# EAGLE board tottag (EAGLE 9.6.2), part 1 of 2
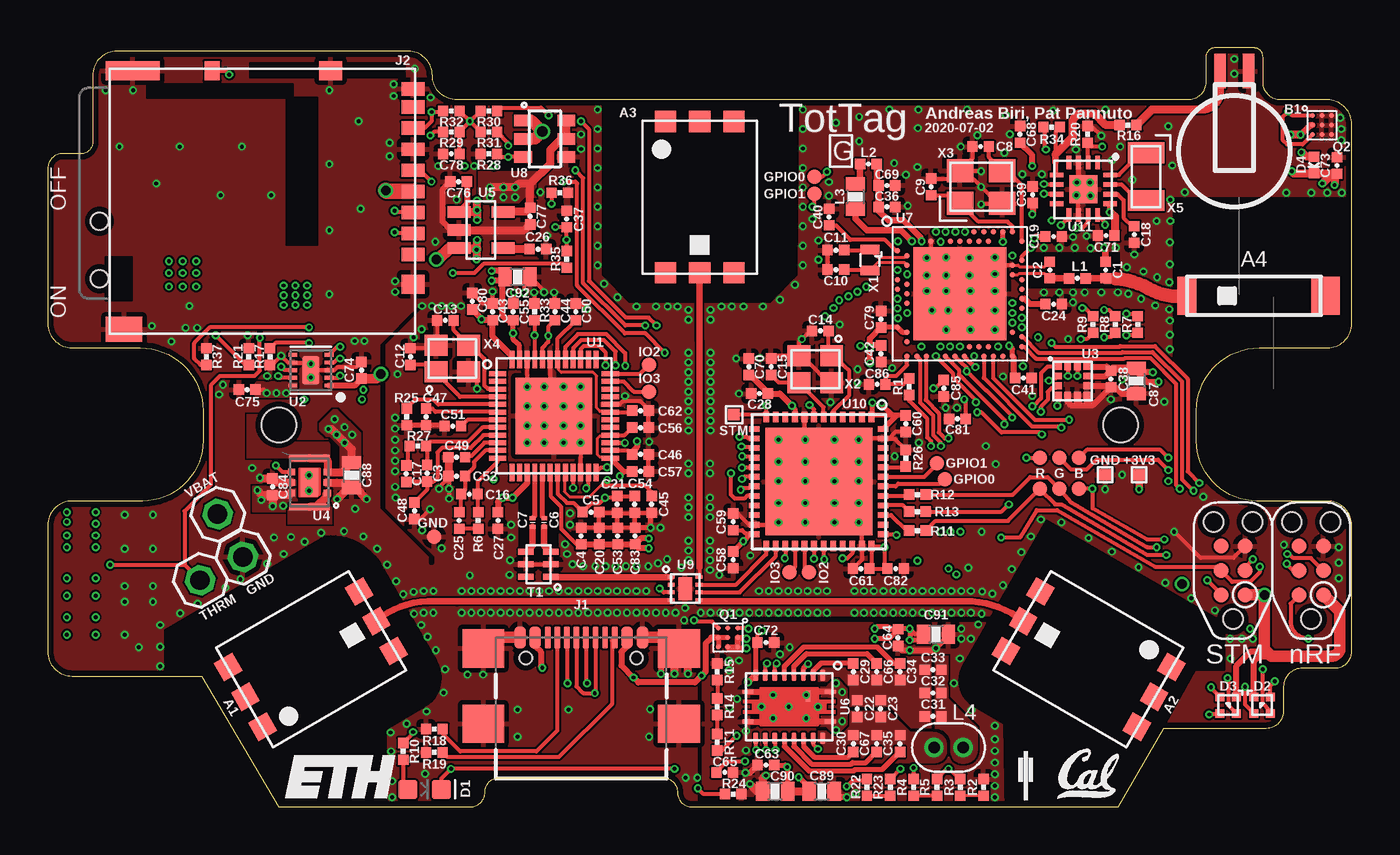
[diagram p4: board, top side]
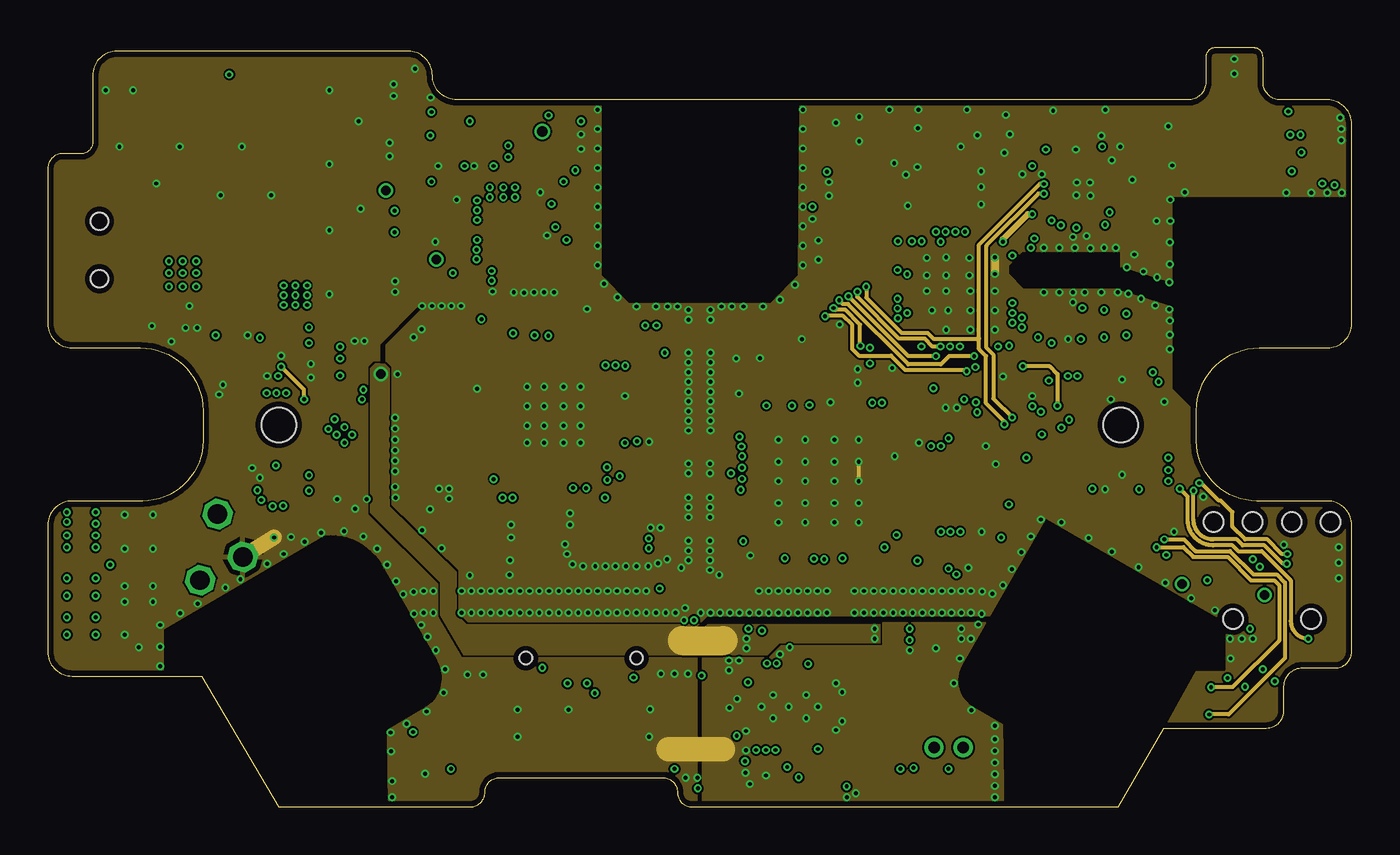
[diagram p5: board, inner layer Route2]
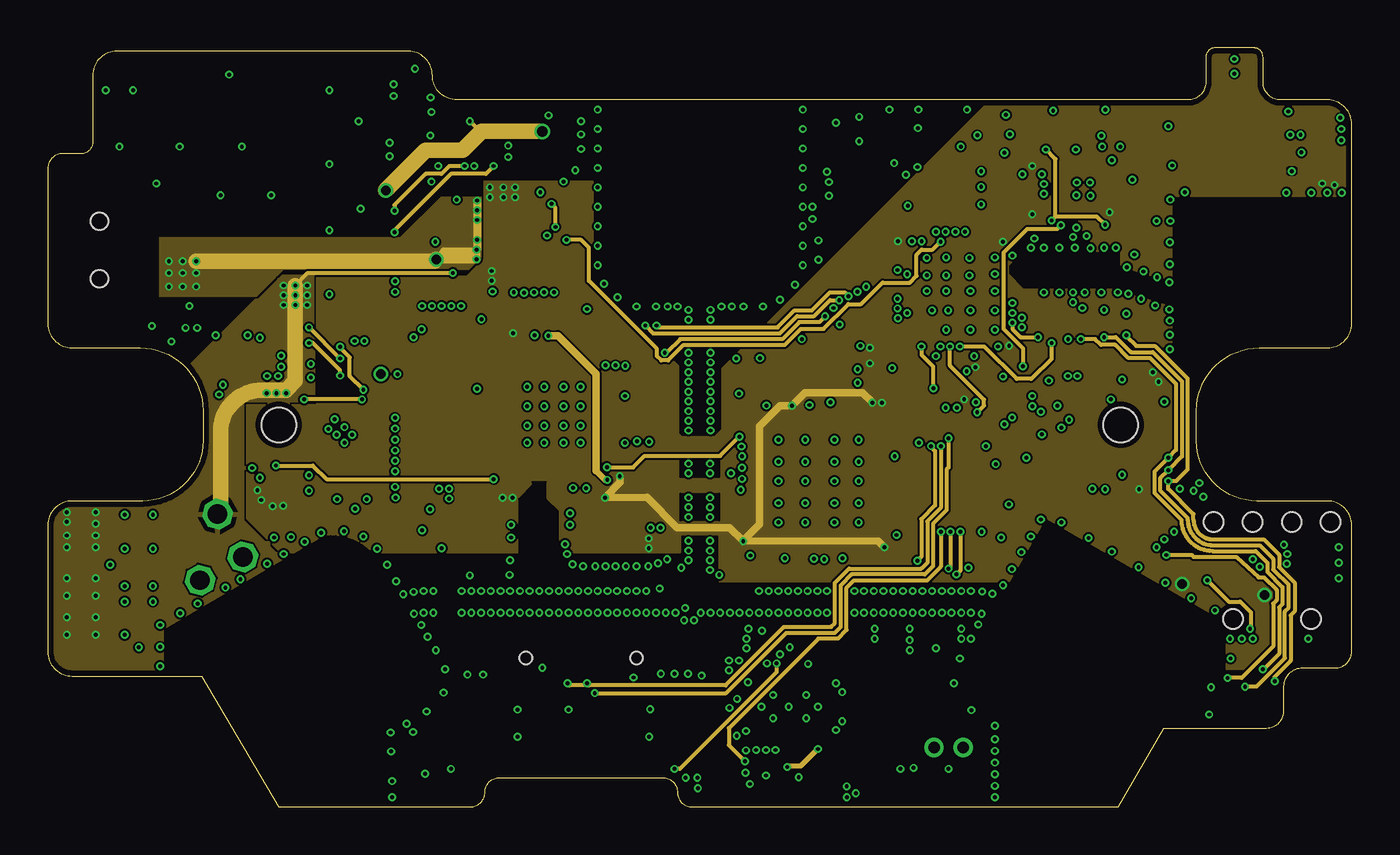
[diagram p6: board, inner layer Route15]
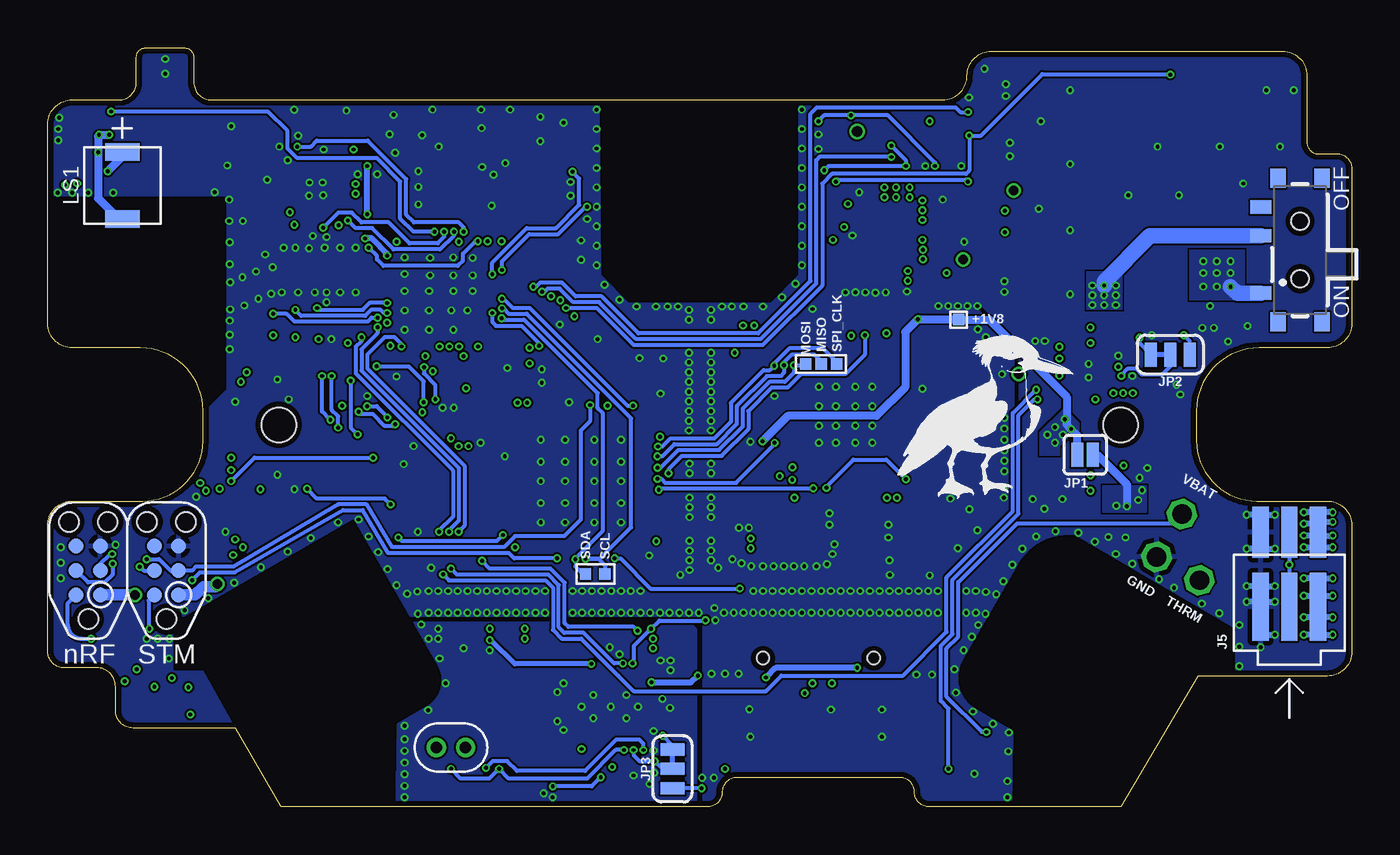
[diagram p7: board, bottom side, seen from below]

Size 68.14 x 39.65 mm. Coordinates in mm from the lower left corner, seen from the top.
Outline: 66.87,36.93 64.42,36.93 arc-90 63.51,37.85 63.51,39.17 arc90 63.02,39.65 60.99,39.65 arc90 60.51,39.17 60.51,37.85 arc-90 59.59,36.93 21.37,36.93 arc-90 20.1,38.2 arc90 18.83,39.47 3.61,39.47 arc90 2.34,38.2 2.34,34.7 arc-90 1.76,34.12 0.76,34.12 arc90 0,33.36 0,25.25 arc90 1.27,23.98 4.83,23.98 arc-90 8.11,20.69 8.11,19.14 arc-90 4.95,15.98 1.27,15.98 arc90 0,14.71 0,8.1 arc90 1.27,6.83 8.03,6.83 12.07,0 22.08,0 arc90 22.84,0.76 arc-90 23.6,1.52 32.14,1.52 arc-90 32.9,0.76 arc90 33.66,0 55.94,0 58.33,4.11 63.68,4.11 arc90 64.6,5.03 64.6,6.3 arc-90 65.56,7.26 67.29,7.26 arc90 68.14,8.11 68.14,14.71 arc90 66.87,15.98 63.18,15.98 arc-90 60.02,19.14 60.02,20.69 arc-90 63.31,23.98 66.87,23.98 arc90 68.14,25.25 68.14,35.66 arc90 66.87,36.93
Copper layers (1+2*15+16): Top 0.0356mm / dielectric 0.18mm / Route2 0.0356mm / dielectric 1.03mm / Route15 0.0356mm / dielectric 0.18mm / Bottom 0.0356mm
Design rules "quickturn_co_kr_1oz_4lyr *": minimum track width 4mil, minimum drill 8mil, track to track 4mil, track to pad 4mil, pad to pad 4mil, via to via 4mil, smd to smd 4mil, copper to edge 12mil, drill to drill 12mil, minimum pad ring 8mil, minimum via ring 4mil, stop-mask expansion 3mil, vias tented up to drill 50mil, thermal gap 10mil
Holes 1.8 mm at 12.07,19.95 56.07,19.95
tKeepout: area 19.3,9.6 to 32.3,11.7; area 34.3,9.6 to 48.8,11.7; area 33.1,12.4 to 35.1,25.7; area 9.7,19.3 to 14.4,20.7; area 53.8,19.3 to 58.3,20.7
tRestrict: area 24.6,13.2 to 26.7,17

## Footprints (pad centres in the part's own frame; a part is rotated, then mirrored left to right if it is on the bottom)
TP06SQ = smd 0.6 x 0.6: TP 0,0
TAIYO-YUDEN-AH086M = smd 1.1 x 1.1: A 0,-3.95; NC0 -1.8,3.95; NC1 0,3.95; NC2 1.8,3.95; NC3 1.8,-3.95; NC4 -1.8,-3.95
AMCA72-2R470G-S1F-T = smd 2 x 1.5: NC 0,3.75 | smd 2 x 1: S1 0,-3.5
MS518SE-FL35E = smd 1.8 x 0.6: + 4.2,0.75; - 4.2,-0.75
0402_CAP = smd 0.536 x 0.546: 1 -0.433,0; 2 0.433,0
0201_CAP = smd 0.3 x 0.21: P$1 0,0.22; P$2 0,-0.22
0603_CAP = smd 0.7 x 1: 1 -0.65,0; 2 0.65,0
LED-0603 = smd 1 x 1: A -0.877,0; C 0.877,0
1MM_SQ_4PAD = smd 0.457 x 0.457: 1 0.432,0.432; 2 0.432,-0.432; 3 -0.432,-0.432; 4 -0.432,0.432
0402_DIODE = smd 0.536 x 0.546: ANODE -0.433,0; CATHODE 0.433,0
PAD.03X.03 = smd 0.762 x 0.762: P$1 0,0
GCT_USB4110-GF-A = smd 0.6 x 1.15: A1/B12 -3.2,1.075; A4/B9 -2.4,1.075; B1/A12 3.2,1.075; B4/A9 2.4,1.075 | smd 0.3 x 1.15: A5 -1.25,1.075; A6 -0.25,1.075; A7 0.25,1.075; A8 1.25,1.075; B5 1.75,1.075; B6 0.75,1.075; B7 -0.75,1.075; B8 -1.75,1.075 | smd 2.18 x 2: S1 -5.11,0.5; S2 5.11,0.5; S3 -5.11,-3.43; S4 5.11,-3.43 | hole 0.65: -2.89,0; 2.89,0
DM3AT-SF-PEJM5 = smd 0.7 x 1.2: 1 3.2,-0.1; 2 2.1,-0.1; 3 1,-0.1; 4 -0.1,-0.1; 5 -1.2,-0.1; 6 -2.3,-0.1; 7 -3.4,-0.1; 8 -4.5,-0.1; B -5.45,-0.1 | smd 1 x 0.8: A -6.4,-10.6 | smd 1 x 1.2: MOUNT0 4.75,-0.1; MOUNT1 -6.4,-4.4 | smd 1 x 2.8: MOUNT2 -6.4,-14.75 | smd 1.3 x 1.9: MOUNT3 7.1,-15.2
TC2030-IDC-NL-2SIDE = smd 0.787 x 0.787: 1 -1.27,-0.635; 2 -1.27,0.635; 3 0,-0.635; 4 0,0.635; 5 1.27,-0.635; 6 1.27,0.635 | smd 0.787 x 0.787 bottom: B1 -1.27,0.635; B2 -1.27,-0.635; B3 0,0.635; B4 0,-0.635; B5 1.27,0.635; B6 1.27,-0.635 | hole 1.016: -2.54,0; 2.54,1.016; 2.54,-1.016
MOLEX-PICO-SPOX-3_SIDE = smd 3.55 x 0.85: 1 -1.725,1.5; 2 -1.725,0; 3 -1.725,-1.5 | smd 2.65 x 0.85: 1SUPP 2.175,1.5; 2SUPP 2.175,0; 3SUPP 2.175,-1.5
1X01 = drill 1.016 octagon: 1 0,0
SMT-JUMPER_2_NO_SILK = smd 0.635 x 1.27: 1 -0.406,0; 2 0.406,0
SMT-JUMPER_3_1-NC_TRACE_SILK = smd 0.635 x 1.27: 1 -1.016,0; 2 0,0; 3 1.016,0
WR222230-26M8-G = drill 0.6: P$1 0,0.762; P$2 0,-0.762
SMT-0440-T-2-R = smd 0.9 x 1.8: + 1.75,0; - -1.75,0
DSBGA = smd 0.25 x 0.25: A1 -0.5,0.5; A2 0,0.5; A3 0.5,0.5; B1 -0.5,0; B2 0,0; B3 0.5,0; C1 -0.5,-0.5; C2 0,-0.5; C3 0.5,-0.5
0402_RES = smd 0.536 x 0.546: 1 -0.433,0; 2 0.433,0
450404015514 = smd 0.7 x 1.1: 1 2.25,-2.05; 2 -0.75,-2.05; 3 -2.25,-2.05 | smd 1 x 0.8: Z1 -3.75,1.15; Z2 3.75,1.15; Z3 3.75,-1.15; Z4 -3.75,-1.15 | hole 0.9: -1.5,0; 1.5,0
EIA-0805 = smd 0.3 x 0.8: 1 -0.65,-0.65; 2 0,-0.65; 3 0.65,-0.65; 4 0.65,0.65; 5 0,0.65; 6 -0.65,0.65
QFN-48-DW1000 = smd 0.9 x 0.26: 1 -2.95,2.2; 2 -2.95,1.8; 3 -2.95,1.4; 4 -2.95,1; 5 -2.95,0.6; 6 -2.95,0.2; 7 -2.95,-0.2; 8 -2.95,-0.6; 9 -2.95,-1; 10 -2.95,-1.4; 11 -2.95,-1.8; 12 -2.95,-2.2; 25 2.95,-2.2; 26 2.95,-1.8; 27 2.95,-1.4; 28 2.95,-1; 29 2.95,-0.6; 30 2.95,-0.2; 31 2.95,0.2; 32 2.95,0.6; 33 2.95,1; 34 2.95,1.4; 35 2.95,1.8; 36 2.95,2.2 | smd 0.26 x 0.9: 13 -2.2,-2.95; 14 -1.8,-2.95; 15 -1.4,-2.95; 16 -1,-2.95; 17 -0.6,-2.95; 18 -0.2,-2.95; 19 0.2,-2.95; 20 0.6,-2.95; 21 1,-2.95; 22 1.4,-2.95; 23 1.8,-2.95; 24 2.2,-2.95; 37 2.2,2.95; 38 1.8,2.95; 39 1.4,2.95; 40 1,2.95; 41 0.6,2.95; 42 0.2,2.95; 43 -0.2,2.95; 44 -0.6,2.95; 45 -1,2.95; 46 -1.4,2.95; 47 -1.8,2.95; 48 -2.2,2.95 | smd 4 x 4: GND 0,0
DSQ0010A = smd 0.5 x 0.2: 1 -0.95,0.8; 2 -0.95,0.4; 3 -0.95,0; 4 -0.95,-0.4; 5 -0.95,-0.8; 6 0.95,-0.8; 7 0.95,-0.4; 8 0.95,0; 9 0.95,0.4; 10 0.95,0.8 | smd 0.9 x 1.5: PAD 0,0
LGA-12 = smd 0.375 x 0.35: 1 -0.75,0.75; 2 -0.75,0.25; 3 -0.75,-0.25; 4 -0.75,-0.75; 7 0.75,-0.75; 8 0.75,-0.25; 9 0.75,0.25; 10 0.75,0.75 | smd 0.35 x 0.375: 5 -0.25,-0.75; 6 0.25,-0.75; 11 0.25,0.75; 12 -0.25,0.75
XCL20X = smd 0.35 x 0.375: 1 -0.55,-0.938; 2 0,-0.938; 3 0.55,-0.938; 4 0.55,0.938; 5 0,0.938; 6 -0.55,0.938 | smd 0.35 x 2.1: 7 -1.275,0; 8 1.275,0 | smd 1.5 x 0.9: PAD 0,0
SOT-23-5 = smd 0.6 x 1.2: 1 -0.95,-1.15; 2 0,-1.15; 3 0.95,-1.15; 4 0.95,1.15; 5 -0.95,1.15
RHL0020A = smd 0.24 x 0.6: 1 -0.775,2.15; 10 -0.775,-2.15; 11 0.775,-2.15; 20 0.775,2.15 | smd 0.6 x 0.24: 2 -1.65,1.75; 3 -1.65,1.25; 4 -1.65,0.75; 5 -1.65,0.25; 6 -1.65,-0.25; 7 -1.65,-0.75; 8 -1.65,-1.25; 9 -1.65,-1.75; 12 1.65,-1.75; 13 1.65,-1.25; 14 1.65,-0.75; 15 1.65,-0.25; 16 1.65,0.25; 17 1.65,0.75; 18 1.65,1.25; 19 1.65,1.75; PAD -0.55,1
AQFN73 = smd 0.3 x 0.3: A8 -1.25,3.25; A10 -0.75,3.25; A12 -0.25,3.25; A14 0.25,3.25; A16 0.75,3.25; A18 1.25,3.25; A20 1.75,3.25; A22 2.25,3.25; A23 2.75,3.25; AA24 3.25,-2.25; AB2 -2.75,-2.5; AC5 -2,-2.75; AC9 -1,-2.75; AC11 -0.5,-2.75; AC13 0,-2.75; AC15 0.5,-2.75; AC17 1,-2.75; AC19 1.5,-2.75; AC21 2,-2.75; AC24 3.25,-2.75; AD2 -2.75,-3.25; AD4 -2.25,-3.25; AD6 -1.75,-3.25; AD8 -1.25,-3.25; AD10 -0.75,-3.25; AD12 -0.25,-3.25; AD14 0.25,-3.25; AD16 0.75,-3.25; AD18 1.25,-3.25; AD20 1.75,-3.25; AD22 2.25,-3.25; AD23 2.75,-3.25; B1 -3.25,2.75; B3 -2.5,2.75; B5 -2,2.75; B7 -1.5,2.75; B9 -1,2.75; B11 -0.5,2.75; B13 0,2.75; B15 0.5,2.75; B17 1,2.75; B19 1.5,2.75; B24 3.25,2.75; C1 -3.25,2.25; D2 -2.75,2; D23 2.75,2; E24 3.25,1.75; F2 -2.75,1.5; F23 2.75,1.5; G1 -3.25,1.25; H2 -2.75,1; H23 2.75,1; J1 -3.25,0.75; J24 3.25,0.75; K2 -2.75,0.5; L1 -3.25,0.25; L24 3.25,0.25; M2 -2.75,0; N1 -3.25,-0.25; N24 3.25,-0.25; P2 -2.75,-0.5; P23 2.75,-0.5; R1 -3.25,-0.75; R24 3.25,-0.75; T2 -2.75,-1; T23 2.75,-1; U1 -3.25,-1.25; U24 3.25,-1.25; V23 2.75,-1.5; W1 -3.25,-1.75; W24 3.25,-1.75; Y2 -2.75,-2; Y23 2.75,-2 | smd 4.85 x 4.85: GND 0,0
TSOT23-6 = smd 0.6 x 0.927: 1 -0.95,-1.126; 2 0,-1.126; 3 0.95,-1.126; 4 0.95,1.126; 5 0,1.126; 6 -0.95,1.126
MLPQ-UT-8 = smd 0.35 x 0.2: 1 -0.725,0.6; 2 -0.725,0.2; 3 -0.725,-0.2; 4 -0.725,-0.6; 5 0.725,-0.6; 6 0.725,-0.2; 7 0.725,0.2; 8 0.725,0.6 | smd 0.7 x 1.2: GND 0,0
UFQFPN-48 = smd 0.55 x 0.3: 1 -3.375,2.75; 2 -3.375,2.25; 3 -3.375,1.75; 4 -3.375,1.25; 5 -3.375,0.75; 6 -3.375,0.25; 7 -3.375,-0.25; 8 -3.375,-0.75; 9 -3.375,-1.25; 10 -3.375,-1.75; 11 -3.375,-2.25; 12 -3.375,-2.75; 25 3.375,-2.75; 26 3.375,-2.25; 27 3.375,-1.75; 28 3.375,-1.25; 29 3.375,-0.75; 30 3.375,-0.25; 31 3.375,0.25; 32 3.375,0.75; 33 3.375,1.25; 34 3.375,1.75; 35 3.375,2.25; 36 3.375,2.75 | smd 0.3 x 0.55: 13 -2.75,-3.375; 14 -2.25,-3.375; 15 -1.75,-3.375; 16 -1.25,-3.375; 17 -0.75,-3.375; 18 -0.25,-3.375; 19 0.25,-3.375; 20 0.75,-3.375; 21 1.25,-3.375; 22 1.75,-3.375; 23 2.25,-3.375; 24 2.75,-3.375; 37 2.75,3.375; 38 2.25,3.375; 39 1.75,3.375; 40 1.25,3.375; 41 0.75,3.375; 42 0.25,3.375; 43 -0.25,3.375; 44 -0.75,3.375; 45 -1.25,3.375; 46 -1.75,3.375; 47 -2.25,3.375; 48 -2.75,3.375 | smd 5.6 x 5.6: GND 0,0
QFN-16-3MM = smd 0.7 x 0.25: 1 -1.4,0.75; 2 -1.4,0.25; 3 -1.4,-0.25; 4 -1.4,-0.75; 9 1.35,-0.75; 10 1.35,-0.25; 11 1.35,0.25; 12 1.35,0.75 | smd 0.25 x 0.7: 5 -0.75,-1.4; 6 -0.25,-1.4; 7 0.25,-1.4; 8 0.75,-1.4; 13 0.75,1.4; 14 0.25,1.4; 15 -0.25,1.4; 16 -0.75,1.4 | smd 1.45 x 1.45: GND 0,0
ABS05 = smd 0.5 x 1: A -0.55,0; B 0.55,0
FA-20H = smd 1.1 x 1.2: 1 -0.7,0.85; 2 -0.7,-0.85; 3 0.7,-0.85; 4 0.7,0.85
TXC-7V = smd 1.4 x 1.2: 1 -1.1,-0.85; 2 1.1,-0.85; 3 1.1,0.85; 4 -1.1,0.85
ABS07 = smd 1.092 x 1.905: 1 -1.245,0; 2 1.245,0

## Placement (x,y rotation side)
+1V8  TPTP06SQ  [TP06SQ]  20.53,25.45 0 bottom
A1  TAIYO-YUDEN-AH086M  [TAIYO-YUDEN-AH086M]  13.75,7.72 120 top
A2  TAIYO-YUDEN-AH086M  [TAIYO-YUDEN-AH086M]  54.39,7.72 240 top
A3  TAIYO-YUDEN-AH086M  [TAIYO-YUDEN-AH086M]  34.07,31.85 0 top
A4  AMCA72-2R47G-S1F-T  [AMCA72-2R470G-S1F-T]  63.02,26.7 270 top
B1  [MS518SE-FL35E]  62.01,34.24 90 top
C1  0.5pF  [0402_CAP]  55.28,28.04 90 top
C2  0.8pF  [0402_CAP]  52.36,28.04 90 top
C3  1.2pF  [0402_CAP]  19.82,17.42 270 top
C4  10pF  [0402_CAP]  27.87,14.15 90 top
C5  10pF  [0402_CAP]  28.38,15.39 0 top
C6  12pF  [0201_CAP]  25.94,14.86 0 top
C7  12pF  [0201_CAP]  25.33,14.86 0 top
C8  12pF  [0402_CAP]  48.75,34.49 0 top
C9  12pF  [0402_CAP]  46.16,32.38 270 top
C10  12pF  [0402_CAP]  41.18,28.07 0 top
C11  12pF  [0402_CAP]  41.18,29.08 0 top
C12  12pF  [0402_CAP]  18.95,23.52 90 top
C13  12pF  [0402_CAP]  20.77,25.41 180 top
C14  12pF  [0402_CAP]  40.37,24.87 180 top
C15  12pF  [0402_CAP]  37.8,22.99 90 top
C16  18pF  [0402_CAP]  22.03,16.33 180 top
C17  27pF  [0402_CAP]  18.73,17.4 270 top
C18  47pF  [0402_CAP]  56.78,29.9 270 top
C19  100pF  [0402_CAP]  52.56,29.79 0 top
C20  330pF  [0402_CAP]  28.81,14.15 90 top
C21  330pF  [0402_CAP]  29.75,15.8 270 top
C22  470pF  [0402_CAP]  42.3,5.13 270 top
C23  470pF  [0402_CAP]  43.52,5.13 270 top
C24  820pF  [0402_CAP]  52.56,26.26 0 top
C25  820pF  [0402_CAP]  21.49,14.96 90 top
C26  10nF  [0402_CAP]  25.61,29.13 0 top
C27  10nF  [0402_CAP]  23.53,14.96 270 top
C28  10nF  [0402_CAP]  37.19,21.59 180 top
C29  10nF  [0402_CAP]  42.09,7.06 270 top
C30  10nF  [0402_CAP]  42.09,3.3 90 top
C31  22nF  [0402_CAP]  46.26,4.72 0 top
C32  22nF  [0402_CAP]  46.26,5.94 0 top
C33  22nF  [0402_CAP]  46.26,7.16 0 top
C34  22nF  [0402_CAP]  44.53,7.06 270 top
C35  22nF  [0402_CAP]  44.53,3.3 90 top
C36  47nF  [0402_CAP]  43.85,31.34 0 top
C37  0.1uF  [0402_CAP]  27.11,30.71 270 top
C38  0.1uF  [0402_CAP]  55.56,22.35 270 top
C39  0.1uF  [0402_CAP]  51.47,31.98 90 top
C40  0.1uF  [0402_CAP]  40.82,30.81 90 top
C41  0.1uF  [0402_CAP]  50.98,22.4 0 top
C42  0.1uF  [0402_CAP]  43.54,23.67 270 top
C43  0.1uF  [0402_CAP]  23.25,25.86 90 top
C44  0.1uF  [0402_CAP]  26.5,25.86 90 top
C45  0.1uF  [0402_CAP]  31.55,15.8 270 top
C46  0.1uF  [0402_CAP]  30.97,18.41 0 top
C47  0.1uF  [0402_CAP]  19.77,20.37 270 top
C48  0.1uF  [0402_CAP]  19.16,15.47 270 top
C49  0.1uF  [0402_CAP]  21.37,18.26 180 top
C50  0.1uF  [0402_CAP]  27.59,25.86 90 top
C51  0.1uF  [0402_CAP]  21.16,19.89 180 top
C52  0.1uF  [0402_CAP]  21.37,17.27 180 top
C53  0.1uF  [0402_CAP]  29.78,14.15 90 top
C54  0.1uF  [0402_CAP]  30.66,15.8 270 top
C55  0.1uF  [0402_CAP]  24.31,25.86 90 top
C56  0.1uF  [0402_CAP]  30.97,19.81 0 top
C57  0.1uF  [0402_CAP]  30.97,17.53 0 top
C58  0.1uF  [0402_CAP]  35.82,12.9 270 top
C59  0.1uF  [0402_CAP]  35.82,14.88 90 top
C60  0.1uF  [0402_CAP]  44.84,20.02 270 top
C61  0.1uF  [0402_CAP]  42.5,12.45 180 top
C62  0.1uF  [0402_CAP]  30.97,20.7 0 top
C63  0.1uF  [0402_CAP]  37.52,2.18 180 top
C64  0.1uF  [0402_CAP]  44.43,8.84 270 top
C65  0.1uF  [0402_CAP]  35.38,1.8 0 top
C66  470nF  [0402_CAP]  43.31,7.06 270 top
C67  470nF  [0402_CAP]  43.31,3.3 90 top
C68  1uF  [0402_CAP]  50.81,35.13 90 top
C69  1uF  [0402_CAP]  43.85,32.46 0 top
C70  1uF  [0402_CAP]  36.63,22.99 90 top
C71  1uF  [0402_CAP]  55.3,29.84 180 top
C72  1uF  [0402_CAP]  37.52,8.59 180 top
C73  1uF  [0402_CAP]  67.37,33.5 90 top
C74  1uF  [0402_CAP]  16.39,22.81 90 top
C75  1uF  [0402_CAP]  10.42,21.79 180 top
C76  4.7uF  [0402_CAP]  21.46,32.66 180 top
C77  4.7uF  [0402_CAP]  25.2,30.86 270 top
C78  4.7uF  [0402_CAP]  21.09,34.11 180 top
C79  4.7uF  [0402_CAP]  43.54,25.48 90 top
C80  4.7uF  [0402_CAP]  22.18,26.42 90 top
C81  4.7uF  [0402_CAP]  47.53,20.27 180 top
C82  4.7uF  [0402_CAP]  44.3,12.45 0 top
C83  4.7uF  [0402_CAP]  30.69,14.15 90 top
C84  4.7uF  [0402_CAP]  11.74,16.71 90 top
C85  4.7uF  [0402_CAP]  46.82,21.87 270 top
C86  4.7uF  [0402_CAP]  43.34,22.07 180 top
C87  10uF  [0603_CAP]  56.88,22.25 270 top
C88  10uF  [0603_CAP]  15.88,17.32 270 top
C89  10uF  [0603_CAP]  40.44,0.81 0 top
C90  10uF  [0603_CAP]  38,0.81 180 top
C91  10uF  [0603_CAP]  46.41,9.02 0 top
C92  47uF  [0603_CAP]  24.54,27.69 0 top
D1  GREEN  [LED-0603]  19.69,0.91 0 top
D2  SML-LX0404SIUPGUSB  [1MM_SQ_4PAD]  63.46,5.31 90 top
D3  SML-LX0404SIUPGUSB  [1MM_SQ_4PAD]  61.68,5.31 0 top
D4  DIODE0402  [0402_DIODE]  66.17,33.53 270 top
GPIO0  TEST-POINT  [PAD.03X.03]  46.87,17.12 0 top
GPIO1  TEST-POINT  [PAD.03X.03]  46.46,17.96 0 top
J1  USB4110-GF-A  [GCT_USB4110-GF-A]  27.87,7.77 0 top
J2  DM3AT-SF-PEJM5  [DM3AT-SF-PEJM5]  19.18,32.05 270 top
J3  TC2030-JLINK-NL-2SIDE  [TC2030-IDC-NL-2SIDE]  66.02,12.34 90 top
J4  TC2030-JLINK-NL-2SIDE  [TC2030-IDC-NL-2SIDE]  61.93,12.34 90 top
J5  MOLEX-PICO-SPOX-3SIDE  [MOLEX-PICO-SPOX-3_SIDE]  3.26,12.17 90 bottom
J6  [1X01]  8.87,15.29 30 top
J7  [1X01]  7.96,11.84 30 top
J8  [1X01]  10.19,13.06 30 top
JP1  JUMPER-SMT_2_NO_SILK  [SMT-JUMPER_2_NO_SILK]  13.93,18.39 180 bottom
JP2  JUMPER-SMT_3_1-NC_TRACE_SILK  [SMT-JUMPER_3_1-NC_TRACE_SILK]  9.48,23.62 180 bottom
JP3  JUMPER-SMT_3_1-NC_TRACE_SILK  [SMT-JUMPER_3_1-NC_TRACE_SILK]  35.49,1.98 90 bottom
L1  4.7nH  [0402_CAP]  53.8,27.61 180 top
L2  15nH  [0402_CAP]  42.88,33.58 180 top
L3  10uH  [0603_CAP]  42.2,31.88 270 top
L4  WR222230-26M8-G  [WR222230-26M8-G]  47.07,3.1 270 top
LS1  PUI_SMT-0440-T-2-R  [SMT-0440-T-2-R]  64.24,32.46 90 bottom
MISO  TPTP06SQ  [TP06SQ]  27.72,23.14 0 bottom
MOSI  TPTP06SQ  [TP06SQ]  28.53,23.14 0 bottom
Q1  CSD75207W15  [DSBGA]  35.54,8.84 270 top
Q2  CSD75207W15  [DSBGA]  66.58,35.61 0 top
R1  4.7  [0402_RES]  45.02,21.95 90 top
R2  97.6  [0402_RES]  48.9,1.02 90 top
R3  97.6  [0402_RES]  47.68,1.02 270 top
R4  162  [0402_RES]  45.24,1.02 270 top
R5  162  [0402_RES]  46.46,1.02 90 top
R6  270  [0402_RES]  22.49,14.96 270 top
R7  1k  [0402_RES]  56.95,25.2 90 top
R8  1k  [0402_RES]  55.78,25.2 90 top
R9  1k  [0402_RES]  54.62,25.2 90 top
R10  1k  [0402_RES]  18.57,2.9 270 top
R11  1k  [0402_RES]  45.45,14.43 180 top
R12  1k  [0402_RES]  45.45,16.31 180 top
R13  1k  [0402_RES]  45.45,15.42 180 top
R14  1k  [0402_RES]  34.98,5.23 270 top
R15  1k  [0402_RES]  34.98,7.06 270 top
R16  1.41k  [0402_RES]  56.45,35.61 0 top
R17  2.2k  [0402_RES]  11.61,23.52 90 top
R18  5.1k  [0402_RES]  20.2,4.06 180 top
R19  5.1k  [0402_RES]  20.2,2.84 180 top
R20  10k  [0402_RES]  54.34,35.13 90 top
R21  10k  [0402_RES]  10.5,23.52 270 top
R22  10k  [0402_RES]  42.81,1.02 270 top
R23  10k  [0402_RES]  44.02,1.02 90 top
R24  10k  [0402_RES]  35.82,0.66 180 top
R25  11k  [0402_RES]  18.75,20.37 90 top
R26  11k  [0402_RES]  44.84,18.21 90 top
R27  16k  [0402_RES]  19.34,18.85 180 top
R28  100k  [0402_RES]  23.04,34.11 180 top
R29  100k  [0402_RES]  21.09,35.26 0 top
R30  100k  [0402_RES]  23.04,36.35 180 top
R31  100k  [0402_RES]  23.04,35.26 180 top
R32  100k  [0402_RES]  21.09,36.35 0 top
R33  100k  [0402_RES]  25.43,25.86 270 top
R34  100k  [0402_RES]  52.46,35.51 180 top
R35  3.3M  [0402_RES]  27.11,28.6 270 top
R36  10M  [0402_RES]  26.75,32.08 180 top
R37  DNP  [0402_RES]  8.29,23.52 270 top
RT1  10k@25C  [0402_RES]  34.98,3.38 270 top
S1  [450404015514]  2.7,29.08 270 bottom
SPI_CLK  TPTP06SQ  [TP06SQ]  26.91,23.14 0 bottom
T1  HHM1595A1  [EIA-0805]  25.64,12.67 90 top
TP1  TPTP06SQ  [TP06SQ]  39.02,12.17 0 bottom
TP2  TPTP06SQ  [TP06SQ]  40.04,12.17 0 bottom
TP3  TPTP06SQ  [TP06SQ]  35.85,20.5 0 top
TP4  TPTP06SQ  [TP06SQ]  55.25,17.35 0 top
TP5  TEST-POINT  [PAD.03X.03]  39.78,12.24 0 top
TP6  TEST-POINT  [PAD.03X.03]  38.77,12.24 0 top
TP7  TEST-POINT  [PAD.03X.03]  52.86,16.61 0 top
TP8  TEST-POINT  [PAD.03X.03]  51.85,16.61 0 top
TP9  TEST-POINT  [PAD.03X.03]  53.88,16.61 0 top
TP10  TEST-POINT  [PAD.03X.03]  20.17,14.1 0 top
TP11  TEST-POINT  [PAD.03X.03]  31.43,23.09 0 top
TP12  TEST-POINT  [PAD.03X.03]  31.43,21.69 0 top
TP13  TEST-POINT  [PAD.03X.03]  40.06,32.92 0 top
TP14  TEST-POINT  [PAD.03X.03]  40.06,32.03 0 top
TP15  TPTP06SQ  [TP06SQ]  57.03,17.35 0 top
TP16  TEST-POINT  [PAD.03X.03]  51.85,18.24 0 top
TP17  TEST-POINT  [PAD.03X.03]  52.86,18.24 0 top
TP18  TEST-POINT  [PAD.03X.03]  53.88,18.24 0 top
U1  DW1000  [QFN-48-DW1000]  26.45,20.42 0 top
U2  BQ24040  [DSQ0010A]  13.75,22.81 180 top
U3  LIS2DW12  [LGA-12]  53.55,22.25 0 top
U4  1.8V  [XCL20X]  13.67,16.94 90 top
U5  MAX8887EZK33+T  [SOT-23-5]  22.63,30.13 270 top
U6  BQ51013B  [RHL0020A]  38.74,5.23 270 top
U7  NRF52840  [AQFN73]  47.66,26.8 0 top
U8  SIP32510  [TSOT23-6]  25.97,34.9 270 top
U9  SKY13317  [MLPQ-UT-8]  33.31,11.4 0 top
U10  STM32F091CC  [UFQFPN-48]  40.29,16.99 270 top
U11  AB1815-T3  [QFN-16-3MM]  54.11,32.26 270 top
U$1  [TOTTERNARY_300MIL]  19.59,16.1 0 bottom
U$2  [UCSD_TRIDENT_SOLID_100MIL]  50.73,0.36 0 top
U$3  [ETH_200MIL]  15.07,0.48 0 top
U$4  [UCB_CAL_100MIL]  52.76,0.46 0 top
X1  32.768kHz  [ABS05]  42.96,28.57 270 top
X2  16MHz  [FA-20H]  40.11,22.86 270 top
X3  32MHz  [TXC-7V]  48.77,32.38 0 top
X4  38.4MHz  [FA-20H]  21.14,23.42 90 top
X5  ABS07-32.768KHZ-7-T  [ABS07]  57.39,32.92 270 top

## Tracks (layer width: path | path; a pad name or v marks a point on that pad's centre or on a via)
!AD_EN  (via drill 0.2)
  Top 0.203: U6.8 37.49,7.41 v37.58,7.49 | v36.61,9.3 36.56,9.34 Q1.A1 | Q1.C1 34.71,9.67 33.9,9.67 33.81,9.75 v33.76,9.75
  Bottom 0.203: v37.58,7.49 37.52,7.55 37.52,8.38 v36.61,9.3 36.18,9.73 33.79,9.73 v33.76,9.75
!CHG  (via drill 0.2)
  Top 0.203: U6.7 37.99,7.4 v38.09,7.49 | D1.C 20.57,1.49 v21.06,1.98 v32.75,1.98 | U2.8 12.38,22.81 v12.2,22.99
  Route2 0.203: v13.39,21.29 13.39,21.79 v12.2,22.99
  Route15 0.203: v38.09,7.49 38.09,7.04 33.03,1.98 v32.75,1.98 | v47.17,14.38 47.17,12.55 v47.07,12.45 | v16.41,21.29 v13.39,21.29
  Bottom 0.203: v38.09,7.49 38.54,7.49 40.14,9.09 41.16,9.09 41.43,9.37 41.43,11.58 41.99,12.14 46.77,12.14 v47.07,12.45 | v21.06,1.98 21.06,5.13 21.47,5.54 21.47,8.41 20.86,9.02 20.86,11.86 17.41,15.32 17.41,20.45 16.57,21.29 v16.41,21.29 | U7.W24 50.91,24.74 51.75,23.9 51.75,22.78 46.67,17.7 46.67,14.95 47.17,14.44 v47.17,14.38
  other vias: 50.91,25.05
!DW_RST  (via drill 0.2)
  Top 0.203: U1.27 v30.15,19.02 v30.15,19.01 | U10.18 36.9,17.26 36.41,17.26 v36.28,17.13
  Bottom 0.203: v30.15,19.01 30.15,18.94 32.17,16.93 35.88,16.93 36.08,17.13 v36.28,17.13
!DW_SPI_CS  (via drill 0.2)
  Top 0.203: U1.24 28.91,17.74 v29.22,17.74 | U10.14 36.59,19.24 36.5,19.33 v36.14,19.33
  Route15 0.203: v29.22,17.74 30.59,17.74 31.19,18.34 35.13,18.34 36.12,19.33 v36.14,19.33
!NRF_CS_IMU  (via drill 0.2)
  Top 0.203: U7.AC11 v47.15,24.05 | U3.2 52.68,22.38 52.53,22.38 52.42,22.27 v52.31,22.27 | v51.95,19.46 51.85,19.56 49.84,19.56 48.79,20.61 v48.56,20.61
  Route15 0.203: v47.15,24.05 47.15,23.05 48.93,21.28 48.93,20.96 48.69,20.73 48.68,20.73 v48.56,20.61
  Bottom 0.203: v52.31,22.27 v52.3,22.26 52.3,19.81 v51.95,19.46
!NRF_CS_RTC  (via drill 0.2)
  Top 0.203: U7.A10 v46.91,30.05 | v52.15,34.34 52.08,34.42 52.08,35.46 R34.2 | U11.12 55.25,30.51 v55.25,30.4
  Route15 0.203: v52.46,30.63 52.66,30.84 | 52.66,30.84 52.66,33.83 v52.15,34.34 | v55.25,30.4 54.82,30.84 52.66,30.84
  Bottom 0.203: v46.91,30.05 46.91,29.84 47.64,29.12 50.08,29.12 51.18,30.23 52.05,30.23 v52.46,30.63
!NRF_CS_SD  (via drill 0.2)
  Top 0.203: v27.57,33.25 27.97,32.84 27.97,27.36 30.18,25.15 v31.22,25.15 | R31.1 24.06,34.67 v24.06,34.54 | J2.2 18.18,29.95 v18.12,30.02
  Route2 0.203: U7.AD16 47.1,23.55 46.67,23.11 44.97,23.11 41.82,26.26 41.56,26.26 v41.36,26.47
  Route15 0.203: v31.22,25.15 31.63,24.74 38.26,24.74 39.15,25.63 40.05,25.63 40.88,26.47 v41.36,26.47 | v23.3,33.48 22.89,33.07 21.06,33.07 18.12,30.12 v18.12,30.02
  Bottom 0.203: v24.06,34.54 23.3,33.78 v23.3,33.48 27.34,33.48 v27.57,33.25
  other vias: 48.41,23.55
!NRF_RST  (via drill 0.2)
  Top 0.203: v64.78,13.21 64.88,13.21 65.09,12.99 66.01,12.99 J3.3 | v52.46,24.23 52.66,24.03 56,24.03 56.04,24.06 57.86,24.06 59.57,22.35 59.57,17.53 v60.18,16.92
  Route2 0.203: v64.78,13.21 64.5,13.21 63.73,13.97 62.57,13.97 61.91,14.64 61.91,15.39 61.3,16 61.19,16 60.28,16.92 v60.18,16.92
  Route15 0.203: U7.AC13 48.93,24.05 50.63,22.35 51.39,22.35 52.46,23.42 v52.46,24.23
  Bottom 0.203: J3.B3 65.39,12.7 64.88,13.21 v64.78,13.21
  other vias: 47.66,24.05
!PG  (via drill 0.2)
  Top 0.203: U2.5 15.12,24.03 v15.27,24.03 | v50.41,25.3 v50.41,25.29
  Route15 0.203: v51.75,24.54 50.83,24.54 50.41,24.96 v50.41,25.29 | v47.68,14.38 47.68,12.34 v47.48,12.14 | v16.49,21.79 15.78,22.5 15.78,23.49 15.27,23.99 v15.27,24.03
  Bottom 0.203: v51.75,24.54 51.75,24.33 52.05,24.03 52.05,22.66 46.97,17.58 46.97,15.15 47.68,14.44 v47.68,14.38 | v47.48,12.14 47.17,11.84 42.13,11.84 41.74,11.45 41.74,9.25 41.28,8.79 40.27,8.79 38.33,6.86 | 38.33,6.86 | 38.33,6.86 37.52,6.05 30.61,6.05 29.8,6.86 23.45,6.86 21.16,9.14 21.16,11.99 17.71,15.44 17.71,20.57 v16.49,21.79
!RTC_IRQ  (via drill 0.2)
  Top 0.203: U11.11 54.36,30.53 54.08,30.25 v53.75,30.25
  Top 0.254: v47.42,30.04 v47.41,30.05 U7.A12
  Bottom 0.203: v47.42,30.04 47.42,29.78 47.77,29.44 49.23,29.44 50.32,30.53 51.75,30.53 52.25,31.04 52.97,31.04 v53.75,30.25
!SD_DETECT  (via drill 0.2)
  Top 0.203: J2.A 9.28,38.45 v9.48,38.25 | R29.1 20.17,35.26 v19.99,35.07
  Route2 0.203: v42.46,24.08 v42.45,24.09 42.45,25.2 41.69,25.96 41.16,25.96 v41.05,26.06
  Bottom 0.203: v9.48,38.25 9.51,38.28 16.17,38.28 19.38,35.07 v19.99,35.07 19.99,34.97 19.98,34.96 19.98,33.24 20.15,33.07 27.16,33.07 27.67,32.56 27.67,27.23 30.77,24.13 37.52,24.13 39.45,26.06 v41.05,26.06 | U7.T2 44.91,25.32 44.71,25.12 43.37,25.12 42.46,24.22 v42.46,24.08
  other vias: 44.91,25.8
!STM_RST  (via drill 0.2)
  Top 0.203: U10.7 40.04,20.76 v39.81,20.99 | J4.3 62.57,12.52 v62.97,12.93
  Bottom 0.203: v39.81,20.99 39.81,20.14 40.29,19.66 40.29,15 41.16,14.14 43.73,14.14 44.3,13.56 50.14,13.56 51.48,15.8 52.97,15.8 58.45,12.55 60.4,12.55 60.6,12.34 J4.B3 61.72,12.34 62.32,12.94 62.82,12.94 62.83,12.93 v62.97,12.93
+1V8  (via drill 0.2)
  Top 0.203: U1.26 29.42,18.6 30.35,18.6 C46.1 30.54,18.53 | U1.48 24.25,23.55
  Top 0.254: v22.66,25.48 22.18,25.96 C80.1
  Top 0.305: 30.54,18.53 30.79,18.79 v30.79,19.09 | 24.25,23.55 23.25,24.55 C43.1 22.74,25.42 C80.1
  Top 0.406: v14.66,19.74 14.83,19.74 15.88,18.68 C88.1 15.4,17.49 U4.3 14.61,18.09 14.48,18.22 U4.8
  Bottom 0.381: 20.56,25.48 +1V8.TP | 14.33,19.41 v14.66,19.74
  Bottom 0.406: 20.56,25.48 v22.66,25.48 23.32,24.81 23.32,21.92 24.82,20.42 29.47,20.42 30.79,19.1 v30.79,19.09 | JP1.2 14.33,19.41 | v14.66,19.74 14.89,19.96 14.89,21.41 18.93,25.45 +1V8.TP
  other vias: 15.91,19.43 14.99,20.24 15.5,19.02 15.09,19.43 15.5,19.84
  pour Top (no thermals): 16.31,19.53 16.31,17.7 15.3,17.7 15.3,18.82 14.76,19.35 14.56,19.35 14.23,19.68 14.23,20.04 14.94,20.75 15.09,20.75
  pour Top (no thermals): 12.63,18.24 12.63,18.03 14.76,18.03 14.76,18.95 14.66,19.05 12.94,19.05 12.83,19.15 12.83,20.47 10.4,20.47 10.4,18.24
  pour Bottom: 15.07,20.78 14.97,20.78 14.26,20.07 14.26,19.66 14.46,19.46 14.66,19.46 15.27,18.85 15.27,18.34 16.29,18.34 16.29,19.56
+3V3  (via drill 0.2, 0.5)
  Top 0.102: U1.28 29.36,19.38 | U1.25 | v36.34,13.88
  Top 0.152: U1.25 29.36,18.26 28.85,18.26 28.72,18.4 28.72,19.25 28.85,19.38 29.36,19.38
  Top 0.203: 44.37,20.45 C60.1 44.12,20.45 | 43.12,20.45 U10.1 43.08,20.41 | U10.36 43.04,12.55 C61.1 C82.1 43.74,12.57 43.74,13.54 v43.73,13.56 | 36.7,14.24 U10.24 36.86,14.29 36.44,14.29 36.28,14.45 C59.1 | U1.19 26.65,16.35 27.12,15.87 27.46,15.87 C5.1 28.42,15.87 28.83,15.87 v29.11,16.15 29.13,16.16 29.68,16.16 C21.1 30.51,16.23 30.59,16.16 C54.1 | C4.1 27.63,13.71 26.84,14.51 26.84,15.66 26.3,16.2 26.3,17.42 U1.18 | 30.09,17.53 C57.1 | C56.1 30.15,19.42 U1.28 | 35.82,13.36 C58.1 | C79.1 43.6,25.05 | v47.89,21.29 47.96,21.21 C81.1 | U7.AD14 48,23.45 48,23.38 48.24,23.14 48.31,23.14 v48.48,22.97 | C70.1 36.71,22.55
  Top 0.254: U10.48 44.37,20.45 | 44.12,20.45 43.59,20.98 v43.59,21.11 | C60.1 43.12,20.45 | 36.7,14.24 v36.34,13.88 35.82,13.36 | U1.25 30.09,17.53 | v29.89,17.28 30.14,17.53 C57.1 | 43.08,20.41 v43.08,21.11 | v38.89,20.96 38.89,20.93 39.03,20.79 U10.9 | U7.Y2 44.66,24.8 U7.W1 43.6,25.05 | U7.AD23 50.41,23.92 v50.23,24.09 | v49.91,29.53 U7.A22 | v44.42,29.55 v44.41,29.55 U7.B1 | v43.73,13.56 43.1,13.56 U10.36 | U1.47 24.64,23.39 24.64,24.1 24.35,24.39 24.31,24.42 v24.31,24.74 C55.1
  Top 0.305: U1.15 25.05,16.91 v24.28,16.15 v23.76,16.15 23.53,15.92 C27.1 | C4.1 C20.1 C53.1 C83.1 | v31.4,13.51 30.89,13.51 C83.1 | C55.1 24,25.42 23.77,25.65 23.77,27.57 C92.1 | v23.2,27.48 23.69,27.48 C92.1 | v23.2,27.99 23.22,28.02 23.56,28.02 C92.1 | U7.AD23 50.45,23.5 50.45,22.5 C41.1 | C39.1 51.47,30.99 v51.44,30.96 | v51.44,33.48 51.42,33.5 51.42,34.09 C68.1 | C79.1 42.96,24.46 v42.96,23.98 | C42.1 43.09,24.11 v42.96,23.98 | v31.4,14.02 31,14.02 C83.1 | U11.13 55.51,31.09 v55.48,31.07 | U3.10 55.34,23 C38.1 55.27,22.5 U3.9 | 36.71,22.55 37.62,21.64 C28.1 38.26,21.59 v38.89,20.96 | v42.96,23.16 v42.96,23.98 | D2.1 63.02,7.57 63.33,7.87 63.94,7.87 | D3.1 62.11,7.37 62.87,8.13 63.68,8.13 | v57.74,22.71 57.07,22.71 C87.1 56.88,22.76 57.44,22.2 v58.05,22.2
  Top 0.381: v57.03,16.59 TP15.TP
  Top 0.406: C71.1 55.76,29.87 55.76,30.84 55.51,31.09 | U8.6 U8.5 26.85,34.9 26.27,34.32 26.27,33.6 25.2,32.54 | C38.1 55.67,22.9 C87.1 | U4.6 12.62,16.28 C84.1 | C84.1 11.21,16.28 v10.95,16.54 | C84.1 v11.74,15.7 | U5.5 25,31.09 C77.1 25.2,32.54 | 25.2,32.54 24.59,32.54 v24.42,32.36 v23.81,32.36 v23.09,32.36 | v65,33.2 65.11,33.09 D4.CATHODE 66.2,33.07 C73.1 | C73.1 67.24,32.94 v67.24,32.49 | C73.1 67.11,33.07 v66.6,32.56
  Top 0.61: J4.1 63.08,11.07 v63.58,11.07 63.58,8.23 63.68,8.13 63.94,7.87 67.09,7.87 arc90 67.52,8.31 67.52,10.21 J3.1
  Route2 0.305: v49.91,29.53 49.91,29.65 51.22,30.96 v51.44,30.96
  Route15 0.203: 43.08,21.13 v43.08,21.11
  Route15 0.381: v36.33,13.89 35.63,14.59 32.88,14.59 31.31,16.17 v29.11,16.15 29.89,16.95 v29.89,17.28 | v43.73,13.56 43.4,13.88 v36.33,13.89 | v36.33,13.89 v36.34,13.88 | v36.33,13.89 37.19,14.77 37.19,19.89 38.26,20.96 v38.89,20.96 v38.9,20.96 39.58,21.64 42.57,21.64 43.08,21.13 | v36.33,13.89
  Bottom 0.203: v48.48,22.97 48.48,22.64 47.89,22.05 v47.89,21.29
  Bottom 0.305: v51.44,30.96 v51.44,33.48
  Bottom 0.406: v11.74,15.7 11.74,16.84 13.29,18.39 JP1.1 | v65,33.2 64.24,33.96 LS1.+
  Bottom 0.61: J3.B1 v63.58,11.07 | J4.B1 60.43,11.07 60,11.51 59.39,11.51 v59.27,11.63
  other vias: 11.16,16.03 12.3,15.72 23.1,31.85 23.81,31.85 24.42,31.85
  pour Route15 (rank 2): 14.05,27.69 14.05,20.98 10.4,20.98 10.4,15.09 12.17,13.31 33.05,13.31 33.05,14.25 35.08,14.25 35.08,11.79 55.5,11.79 60,7.21 67.98,7.21 67.98,15.33 67.3,15.98 59.91,15.98 59.9,15.98 59.95,20.55 arc-90 63.43,24.03 67.09,24.03 arc90 68.1,25.04 68.1,32.66 68.05,32.66 68.05,36.53 64.27,40.31 60.86,40.31 57.49,36.93 49.28,36.93 35.24,22.89 35.24,19.71 34.84,19.3 33.15,19.3 32.95,19.5 32.95,23.01 28.48,27.48 28.48,32.66 22.79,32.66 22.79,28.6 21.88,27.69
  pour Top (rank 2, no thermals): 13.01,16.74 13.01,15.42 10.73,15.42 10.73,16.74
  pour Bottom (rank 2, no thermals): 13.01,16.74 13.01,15.42 10.73,15.42 10.73,16.74
  pour Top (no thermals): 22.49,32.87 22.49,31.85 22.79,31.55 22.89,31.55 24.62,31.55 24.92,31.85 25.53,31.85 25.53,33.17 22.49,33.17
  cutout Top: 68.61,20.27 60.38,20.27 58.81,21.84 58.81,31.85 68.61,31.85
  cutout Bottom: 69.22,20.27 60.38,20.27 58.81,21.84 58.81,31.85 69.22,31.85
  cutout Route15: 69.02,20.27 60.38,20.27 58.81,21.84 58.81,31.85 69.02,31.85
  cutout Route2: 68.82,20.27 60.38,20.27 58.81,21.84 58.81,31.85 68.82,31.85
  cutout Route15: 64.75,33.17 64.75,33.27 64.75,33.38 64.85,33.48 65.16,33.48 65.26,33.38 65.26,33.07 65.16,32.97 64.85,32.97 64.75,33.07
ANT_SEL1  (via drill 0.2)
  Top 0.152: U9.3 32.66,11.2
  Top 0.203: U10.27 38.54,13.01 v38.51,12.98 | v31.97,11.4 32.18,11.2 32.66,11.2
  Bottom 0.203: v38.51,12.98 38.21,12.98 36.63,11.4 v31.97,11.4
ANT_SEL2
  Top 0.203: U9.6 36.15,11.2 38.04,13.09 U10.26
ANT_SEL3
  Top 0.203: U10.25 37.54,13.19 35.97,11.61 33.95,11.61 U9.7
BATIN  (via drill 0.2)
  Top 0.203: U7.B9 v46.66,29.53 | v26.52,30.29 26.54,30.28 C37.2 v27.11,29.62 R35.1 | R36.2 v26.32,31.5
  Route15 0.203: v46.66,29.53 46.24,29.11 45.66,29.11 45.4,28.84 45.4,27.74 45.04,27.38 43.62,27.38 42.5,26.26 41.83,26.26 40.54,24.97 39.35,24.97 38.51,24.13 33.23,24.13 32.42,23.32 32.06,23.32 31.83,23.55 31.83,23.93 28.28,27.48 28.28,29.21 27.87,29.62 v27.11,29.62 | v26.52,30.29 26.52,31.29 v26.32,31.5
BATT_THERM  (via drill 0.2)
  Top 0.203: v11.08,24.51 11.08,22.78 10.79,22.5 8.99,22.5 8.52,22.02 8.52,16.83 7.14,15.45 7.14,12.65 | 7.14,12.65 J7.1 | v3.26,12.65 7.14,12.65
  Bottom 0.203: J5.2SUPP v3.26,12.65 J5.2 | JP2.3 11.08,24.21 v11.08,24.51
BATT_TS  (via drill 0.2)
  Top 0.203: U2.9 12.13,22.41 v12.04,22.5
  Bottom 0.203: v12.04,22.5 12.04,22.56 11.68,22.91 11.28,22.91 10.98,22.61 9.89,22.61 9.48,23.01 JP2.2
BLE_ANT
  Top 0.33: L1.1 C1.1
  Top 0.61: C1.1 55.81,27.58
  Top 0.711: 55.81,27.58 arc-28 57.54,27.08 arc39 A4.S1
BQ_AC1
  pour Top (rank 2, no thermals): 46.16,7.87 46.16,4.11 45.14,4.11 44.02,5.23 41.48,5.23 41.48,6.53 40.27,6.53 40.27,7.87
BQ_AC2
  pour Top (rank 2, no thermals): 40.27,2.29 40.27,3.96 41.48,3.96 41.48,5.03 43.92,5.03 45.04,3.91 46.26,3.91 arc-90 46.97,3.2 46.97,2.9 arc-90 46.26,2.29
BQ_BOOT1
  Top 0.254: U6.3 39.99,7.09 40.42,7.52 42.07,7.52 C29.1
BQ_BOOT2
  Top 0.254: U6.17 39.49,3.16 40.06,2.59 41.82,2.59 C30.1
BQ_CLAMP1
  Top 0.254: U6.5 38.99,7.34 39.66,8 42.81,8 C66.1
BQ_CLAMP2
  Top 0.254: U6.16 38.99,3.16 39.91,2.24 41.97,2.24 42.05,2.31 42.76,2.31 C67.1
BQ_COMM1
  Top 0.254: U6.6 38.49,7.34 39.51,8.36 43.31,8.36 44.18,7.49 C34.1
BQ_COMM2
  Top 0.254: C35.1 43.62,1.96 42.2,1.96 42.12,1.88 39.77,1.88 38.49,3.15 U6.15
BQ_FOD  (via drill 0.2)
  Top 0.152: R3.1 47.6,1.45 v47.07,1.98
  Top 0.203: U6.14 37.99,3.01 v38.03,2.97 | v44.56,1.98 R23.2 | R5.2 46.99,1.98 v47.07,1.98
  Bottom 0.203: v38.03,2.97 38.46,2.97 39.96,1.47 44.05,1.47 v44.56,1.98 45.07,1.47 46.56,1.47 v47.07,1.98
BQ_ILM  (via drill 0.2)
  Top 0.203: U6.12 36.99,2.99 v37.01,2.97 | v45.24,2.03 R4.1
  Bottom 0.203: v37.01,2.97 37.01,3.3 37.22,3.51 38.44,3.51 40.06,1.88 43.62,1.88 44.13,2.39 44.89,2.39 v45.24,2.03
BQ_RECT  (via drill 0.2)
  Top 0.203: v41.75,1.07 42.05,1.37 42.73,1.37 R22.1 | U6.18 39.99,3.27 v40.24,3.02
  Top 0.254: C63.1 38.54,2.18 v38.64,2.08 38.66,2.07 C90.1 | C89.1 39.79,0.99 v39.24,1.54
  Top 0.406: C90.1 C89.1
  Route15 0.254: v38.64,2.08 38.68,2.13 39.34,2.13 v40.24,3.02
  Bottom 0.203: v39.24,1.54 39.72,1.07 v41.75,1.07
BUZZER_GATE  (via drill 0.2)
  Top 0.203: U7.A14 v47.93,30.05 | Q2.A1 65.04,36.11 v64.83,36.32 64.52,36.02 64.52,34.85 64.77,34.6 65.57,34.6 Q2.C1
  Bottom 0.203: v47.93,30.05 49.03,30.05 49.71,30.73 49.71,32.66 50.93,33.88 55.1,33.88 55.61,34.39 55.61,35.31 56.62,36.32 v64.83,36.32
COIL_AC1
  pour Top (no thermals): 46.36,7.87 46.36,4.11 arc-90 47.17,3.3 47.17,2.9 arc90 47.78,2.29 47.89,2.29 arc90 48.6,3 48.6,4.11 47.07,5.64 47.07,7.87
D+  (via drill 0.2)
  Top 0.203: U7.AD6 45.88,23.52 45.88,21.26 46.56,20.57 46.56,19.56 46.87,19.25 v47.07,19.25 | J1.B6 28.62,5.98 v28.58,5.94 27.97,5.94 27.62,6.3 J1.A6
  Route15 0.203: v28.58,5.94 35.44,5.94 38.59,9.09 41.13,9.09 41.43,9.4 41.43,11.57 42,12.14 45.83,12.14 46.26,12.57 46.26,14.78 46.97,15.49 46.97,17.63 47.07,17.73 v47.07,19.25
D-  (via drill 0.2)
  Top 0.203: U7.AD4 45.57,23.38 45.57,21.13 46.26,20.45 46.26,19.43 46.67,19.03 v46.67,18.85 | J1.B7 27.12,6.49 v27.16,6.45 | J1.A7 28.12,6.51 v28.17,6.45
  Route15 0.203: v27.16,6.45 27.26,6.35 28.28,6.35 | 28.28,6.35 35.41,6.35 38.46,9.4 40.93,9.4 41.13,9.6 41.13,11.7 41.88,12.45 45.65,12.45 45.95,12.75 45.95,14.91 46.67,15.62 v46.67,18.85 | v28.17,6.45 28.28,6.35
DW_IRQ  (via drill 0.2)
  Top 0.203: U1.45 25.45,24.44 25.44,24.44 v25.44,24.64 25.44,25.41 R33.2 | U10.20 36.54,16.24 36.41,16.1 35.9,16.1 35.69,16.31 v35.69,17.42
  Bottom 0.203: v25.44,24.64 25.44,23.62 26.46,22.61 28.78,22.61 29.5,21.89 30.31,21.89 31.53,20.68 31.53,19.74 32.92,18.34 34.98,18.34 35.69,17.63 v35.69,17.42
DW_SPI_CLK  (via drill 0.2)
  Top 0.203: U1.41 27.05,24.03 27.7,24.69 29.18,24.69 30.17,23.7 v30.17,23.04 | v36.25,18.83 36.35,18.83 36.39,18.79 36.86,18.79 U10.15
  Bottom 0.203: v36.25,18.83 36.02,18.83 35.59,19.25 33.3,19.25 32.44,20.12 32.44,21.1 30.73,22.81 30.4,22.81 v30.17,23.04 30.17,23.16 29.39,23.95 27.64,23.95 26.9,23.21 SPI_CLK.TP
DW_SPI_MISO  (via drill 0.2)
  Top 0.203: U1.40 27.46,23.39 27.46,23.98 27.87,24.38 29.06,24.38 29.67,23.77 v29.67,23.06 | v36.28,18.32 36.31,18.29 36.86,18.29 U10.16
  Bottom 0.203: v36.28,18.32 36.02,18.32 35.39,18.95 33.18,18.95 32.14,19.99 32.14,20.95 32.12,20.95 30.56,22.5 29.83,22.5 29.67,22.67 v29.67,23.06 29.67,23.21 29.24,23.64 28.09,23.64 27.72,23.27 MISO.TP
DW_SPI_MOSI  (via drill 0.2)
  Top 0.203: U1.39 27.86,23.39 27.86,23.93 28.01,24.08 28.81,24.08 29.14,23.75 v29.14,23.06 | v36.28,17.71 v36.28,17.72 36.89,17.72 U10.17
  Bottom 0.203: MOSI.TP 28.61,23.06 v29.14,23.06 29.14,22.68 29.62,22.2 30.43,22.2 31.83,20.8 31.83,19.86 33.05,18.64 35.19,18.64 36.12,17.71 v36.28,17.71
DW_WAKEUP  (via drill 0.2)
  Top 0.203: 28.24,17.46 28.24,16.75 v28.13,16.65 | U10.19 36.71,16.74 36.64,16.67 36.31,16.67 v36.21,16.56 | U1.23 28.24,17.46 | 28.24,17.46
  Bottom 0.203: v28.13,16.65 28.16,16.62 36.27,16.62 v36.21,16.56 | v36.21,16.56
EXT_I2C_SCL  (via drill 0.2)
  Top 0.203: U10.30 v40.04,12.95 | v44.41,26.04 v44.41,26.05
  Bottom 0.203: v44.41,26.04 44.33,26.04 44.05,25.76 43.12,25.76 37.65,20.29 37.65,14.6 39.3,12.95 v40.04,12.95 39.35,12.95 39.02,12.62 TP1.TP
EXT_I2C_SDA  (via drill 0.2)
  Top 0.203: U10.31 40.54,12.96 v40.57,12.93 | U7.U1 v44.42,25.53
  Bottom 0.203: v44.42,25.53 44.34,25.45 43.25,25.45 39.4,21.61 39.4,20.83 39.13,20.56 39.13,14.44 40.57,13 v40.57,12.93 40.57,12.55 40.19,12.17 TP2.TP
GND  (via drill 0.2)
  Top 0.102: 47.4,27.43 47.4,27.05 U7.GND 45.93,28.52 v45.93,28.68
  Top 0.152: U1.GND 25.3,21.56 | U1.GND v27.85,19.02 | U1.GND v27.84,19.02 | U7.F23 50.69,28.3 50.77,28.22 52.1,28.22 C2.2
  Top 0.203: 43.92,19.21 43.7,19.21 U10.47 42.67,19.24 | 43.92,19.21 44.29,19.58 C60.2 | R26.2 44.27,19.21 43.92,19.21 | 40.55,16.74 42.54,14.74 U10.35 42.54,12.92 C61.2 | 40.55,16.74 40.35,16.93 | 40.55,16.74 38.55,14.74 U10.23 36.65,14.74 36.07,15.32 C59.2 | U10.8 39.54,17.74 | U10.8 39.57,20.4 U10.8 | 42.67,19.24 40.35,16.93 | U1.43 26.25,20.62 | 26.25,20.62 U1.GND | U1.46 25.05,21.82 25.3,21.56 26.25,20.62 | v27.85,19.02 U1.22 | T1.5 T1.2 | C53.2 C83.2 30.69,15.34 | C53.2 C20.2 | C20.2 C4.2 C20.2 | C20.2 C5.2 | C5.2 | C53.2 29.77,15.34 | 29.77,15.34 C21.2 28.84,15.37 C5.2 | 30.69,15.34 C54.2 C45.2 | 29.77,15.34 30.69,15.34 | C57.2 C46.2 | C56.2 C62.2 | 31.31,20.7 C62.2 | U1.32 29.88,21.02 30.04,21.18 30.96,21.18 31.4,20.73 C62.2 | C5.2 | X2.2 39.26,24.3 v39.4,24.43 39.83,24.87 C14.2 | X2.4 40.8,22.16 39.71,23.24 39.73,23.24 39.42,23.56 X2.2 | U10.8 39.54,17.74 | 39.54,17.74 U10.GND | C5.2 | C20.2 C5.2 | C5.2 28.91,15.49 C5.2 | C20.2 C5.2 | C20.2 C5.2 | C5.2 | 39.54,17.74 U10.GND | U10.8 39.54,17.74 | C20.2 C5.2 | C20.2 C5.2 | C5.2 | 40.35,16.93 U10.GND | 40.35,16.93 | C53.2 C20.2 | U10.8 39.54,17.74 | 39.54,17.74 U10.GND | 42.67,19.24 40.35,16.93 | U7.F23 48.7,28.3 48.55,28.45 47.66,27.56 47.66,27.18 | 47.66,27.18 U7.GND | U7.B7 46.16,28.68 47.4,27.43 47.66,27.18 | C11.1 C10.1 | C13.2 20.34,24.17 X4.4 20.12,23.95 C12.2 | v19.97,15.54 19.46,15.04 C48.2 | C80.2 22.74,26.29 C43.2 v23.25,26.92 | v25.41,26.87 25.43,26.85 R33.1 | v26.45,26.87 26.45,26.34 C44.2 | C50.2 27.89,26.29 v28.17,26.01 | v22.43,21.84 22.43,22.27 X4.2 | C8.1 48.32,33.88 X3.4 | C9.1 47.26,32.82 X3.4 | v48.77,31.47 49.81,31.47 X3.2 49.62,31.53 v48.77,32.38 47.92,33.23 X3.4 | v20.96,16.1 v20.96,16.61 20.96,17.25 C52.2 20.93,17.17 20.45,16.69 v20.45,16.61
  Top 0.203: U11.10 53.86,31.85 v53.75,31.95 | v13.75,22.43 14.13,22.81 U2.3 14.97,22.81 15.14,22.99 16.13,22.99 C74.2 | v13.75,23.14 13.68,23.21 U2.7 12.56,23.21 v12.2,23.57 11.71,23.09 R17.1 | U6.PAD 39.69,5.78 v39.63,5.84 | R20.2 54.54,35.56 v55.05,35.05 | X2.2 37.94,23.56 C15.2 | v48.77,33.2 47.71,33.2 X3.4 | v24.35,26.87 24.35,26.33 C55.2 | v24.89,26.86 24.89,27.38 C92.2 25.93,26.95 v25.93,26.89 | J4.5 61.96,13 60.23,13 v58.86,14.38
  Top 0.254: C51.2 20.68,19.94 C47.2 R25.1 | C83.2 v31.5,14.58 31.5,15.31 C45.2 | U11.3 53.86,32.69 v53.78,32.61 53.78,32.59 U11.GND | C91.2 47.06,8.93 v46.41,8.28
  Top 0.305: U6.10 37.74,6.01 v37.9,5.84 | U6.11 37.74,4.46 v37.9,4.62 | U6.20 39.8,4.46 v39.63,4.62 | C90.2 37.06,0.81 | v36.46,1.78 36.68,1.78 C63.2 | v41.75,0.51 41.4,0.51 C89.2 | U6.1 39.97,6.01 U6.PAD | U3.5 53.3,21.15 53.47,20.98 53.98,20.98 | 53.98,20.98 54.49,20.98 | U3.6 53.8,21.16 53.98,20.98 | U3.7 54.3,21.17 54.49,20.98 | J1.S2 32.04,7.33 v32.04,6.96 | 54.49,20.98 54.62,20.98 C38.2 | C38.2 55.79,21.92 56.11,21.59 56.87,21.59 C87.2 | U3.8 55.47,22 C38.2 | U5.2 21.05,30.13 20.63,30.56 20.63,32.26 C76.2 | C64.2 44.66,8.18 v45.04,8.18 46.31,8.18 v46.41,8.28
  Top 0.33: C1.2 55.28,29.06 55.2,29.13 v55.2,29.21
  Top 0.406: 37.06,0.81 v36.68,1.19 | U4.5 11.95,16.94 C84.2 11.13,17.15 v11.08,17.2 | C49.2 C52.2 | U4.2 15.61,16.94 C88.2 | C88.2 16.07,16.67 v16.67,16.08 | C88.2 15.71,16.67 v15.12,16.08 | U5.2 24.91,30.13 C77.2 | v32.75,6.96 32.75,8.04 J1.S2 33.46,7.79 v33.46,6.96 | v37.52,1.64 37.35,1.47 C90.2
  Top 0.61: J1.B1/A12 32.41,8.85 J1.S2 | J1.A1/B12 23.33,8.85 J1.S1
  Route2 0.203: v42.37,18.03 v42.37,17.02
  Route2 0.406: v49.49,28.7 v49.49,27.84
  Route2 0.813: J8.1 v11.82,14.07
  Route2 1.27: 32.44,3 35.29,3
  Bottom 0.305: J5.1 4.76,8.99 v4.02,8.99 | 4.76,10.72 v4.02,10.72 | 4.76,11.53 v4.02,11.53 | J5.1 4.76,11.53 | 4.76,11.53 v5.49,11.53 | J5.1 4.76,10.72 | 4.76,10.72 v5.49,10.72 | 4.76,13.49 v4.02,13.49 | 4.76,15.27 v4.02,15.27 | 4.76,15.27 J5.1SUPP 4.76,13.49 | 4.76,15.27 v5.49,15.27 | 4.76,13.49 v5.49,13.49
  other vias: 19.11,11.23 20.15,11.28 21.62,11.28 22.13,11.28 22.64,11.28 23.15,11.28 23.65,11.28 24.16,11.28 24.67,11.28 25.18,11.28 25.69,11.28 26.19,11.28 26.7,11.28 27.21,11.28 27.72,11.28 28.23,11.28 28.73,11.28 29.24,11.28 29.75,11.28 30.26,11.28 30.77,11.28 31.27,11.28 32.37,12.93 31.88,12.73 33.1,12.5 33.48,12.88 33.48,13.39 33.48,13.89 33.48,15.14 33.48,15.65 33.48,16.15 33.48,17.42 33.48,17.93 33.48,19.66 34.63,19.66 34.6,17.42 33.48,22.2 33.48,22.71 33.48,23.22 33.48,23.72 34.63,23.72 34.63,23.22 34.63,22.71 34.63,22.2 34.63,21.69 34.63,21.18 34.6,16.15 34.6,15.65 34.6,15.14 34.6,13.89 34.6,13.39 34.6,12.88 34.6,12.37 35.08,12.12 37.67,11.28 38.18,11.28 38.69,11.28 39.2,11.28 39.71,11.28 40.21,11.28 40.72,11.28 42.15,11.28 43.67,11.28 44.18,11.28 44.69,11.28 45.19,11.28 45.7,11.28 46.21,11.28 46.72,11.28 47.23,11.28 47.73,11.28 48.24,11.28 27.84,21.95 25.94,21.95 25.05,21.95 25.05,20.93 25.94,20.93 26.96,21.95 27.84,20.93 26.96,20.93 27.84,19.91 26.96,19.02 25.94,19.02 25.05,19.02 25.05,19.91 25.94,19.91 26.96,19.91 38.18,19.18 39.58,19.18 41.1,19.18 42.37,19.18 41.1,18.03 38.18,18.03 41.1,17.02 39.58,17.02 39.58,15.88 39.58,14.86 38.18,14.86 41.1,14.86 42.37,14.86 42.37,15.88 41.1,15.88 38.18,15.88 36.13,21.59 18.57,11.1 19.13,10.08 20.15,10.13 21.62,10.13 22.13,10.13 22.64,10.13 23.15,10.13 23.65,10.13 24.16,10.13 24.67,10.13 25.18,10.13 25.69,10.13 26.19,10.13 26.7,10.13 27.21,10.13 27.72,10.13 28.23,10.13 28.73,10.13 29.24,10.13 29.75,10.13 30.26,10.13 30.77,10.13 31.27,10.13 31.78,10.13 32.29,10.13 32.8,10.13 33.31,10.39 34.12,10.13 34.63,10.13 35.13,10.13 35.64,10.13 36.15,10.13 36.66,10.13 37.17,10.13 37.67,10.13 38.18,10.13 38.69,10.13 39.2,10.13 39.71,10.13 40.21,10.13 40.72,10.13 43.67,10.13 44.18,10.13 44.69,10.13 45.19,10.13 45.7,10.13 46.21,10.13 46.72,10.13 47.23,10.13 47.73,10.13 48.24,10.13 19.56,14.45 18.27,22.61 27.13,13.21 45.52,19.02 39.58,18.03 38.18,17.02 18.19,11.79 19.51,9.5 19.84,8.89 48.62,9.53 48.24,8.79 49.36,11.13 50.37,12.42 49.92,11.58 33.48,25.45 32.9,26.14 32.39,26.14 34.63,25.45 35.21,26.14 35.74,26.14 48.83,11.25 48.8,10.08 18.14,27.46 19.11,24.54 18.14,19.76 21.93,6.91 42.15,10.13 45.93,26.95 47.05,25.93 48.22,25.93 49.49,25.93 45.93,27.76 46.95,28.7 46.95,27.76 49.49,26.95 48.22,26.95 14.28,14.33 16.49,14.12 15.48,14.4 53.58,26.37 52.86,26.87 52.05,26.87 45.45,33.43 41.38,25.2 35.97,23.42 40.9,21.13 36.71,13.13 20.07,26.16 18.14,26.9 20.58,26.16 53.32,24.43 49.54,17.91 49.03,18.85 48.11,12.5 49.92,22.48 48.8,14.38 51.37,14.12 51.9,15.01 39.05,27.28 42.4,36.04 45.47,35.46 58.63,24.66 44.25,18.31 50.88,13.31 20.28,8.18 20.76,7.19 20.68,5.97 19.79,4.98 33.26,9.75 17.74,12.65 17.2,13.49 31.43,3.66 47.35,6.45 47.66,7.75 56.14,17.35 20.4,33.48 20.58,13.51 27.03,13.72 24.54,3.66 48.27,5.05 27.41,12.67 27.97,12.57 28.61,12.57 29.14,12.57 29.67,12.57 30.21,12.57 30.77,12.57 31.38,12.57 24.14,12.12 22.05,12.09 24.16,12.88 24.21,14.73 24.21,14.07 18.14,20.32 19.54,24.94 55.25,16.59 53.58,26.87 55.05,26.87 52.05,29.21 52.86,29.21 53.68,29.21 56.39,28.19 57.87,26.19 54.49,29.18 49.99,34.16 55.81,29.21 47.71,34.49 41.18,35.74 54.46,32.61 54.49,31.93 43.97,36.42 53.73,34.34 52.53,36.37 48.04,36.42 45.5,36.42 58.63,29.49 58.55,35.56 55.26,36.42 56.04,34.49 54.18,26.87 58.6,27.41 58.6,25.98 13.42,13.84 12.33,13.21 11.46,12.7 10.06,11.89 9.28,11.46 7.83,10.62 6.92,10.11 5.87,9.5 5.87,7.34 5.87,8.36 20.25,29.51 21.37,31.72 25.74,32.11 26.09,29.84 36.35,26.14 37.37,26.14 31.78,26.14 30.77,26.14 29.78,26.62 29.06,27.33 28.73,36.42 28.73,35.41 28.73,34.39 28.73,33.38 28.73,32.36 28.73,31.34 28.73,30.33 28.73,29.31 28.73,28.3 62.01,39.07 67.47,13.56 61.78,8.79 52.97,14.86 54.39,14.05 55.61,13.34 57,12.52 58.4,11.71 61.8,7.75 60.99,10.26 59.75,10.9 46.95,24.92 48.22,24.92 49.49,24.92 58.76,33.5 59.42,32.11 58.63,28.35 57.97,27.66 51.95,33.05 38.26,26.49 44.23,33.63 22.28,33.48 39.45,36.42 39.45,35.41 39.45,34.39 39.45,33.38 39.45,32.36 39.45,31.34 39.45,30.33 39.45,29.31 39.45,28.3 44.84,33.02 44.94,31.39 46.95,26.95 46.21,25.93 34.6,17.93 33.48,21.69 33.48,21.18 33.48,20.68 33.48,20.17 34.63,20.68 34.63,20.17 33.48,25.96 34.63,25.96 40.27,28.57 40.27,29.59 40.82,31.93 42.4,34.77 48.16,27.76 48.16,28.68 18.07,37.74 19.18,38.56 17.86,34.7 17.86,33.99 30.16,21.46 4.45,37.44 3.03,37.44 4.76,8.33 6.46,24.31 31.48,5.11 27.87,34.37 27.87,35.13 20,37.06 18.07,37.13 31.43,19.08 27.29,14.73 27.29,15.34 32.01,14.58 55.61,33.78 54.29,29.82 56.67,32.77 9.15,22.05 64.73,32.08 18.75,4.34 17.91,3.89 17.94,2.9 12.71,14.1 17.99,1.35 17.99,0.51 38.72,5.23 37.29,5.23 40.24,5.23 49.49,0.51 49.49,4.24 49.49,3.53 49.49,2.92 49.49,2.31 49.49,1.7 49.49,1.09 33.94,1.52 19.72,1.73 36.48,2.95 33.33,1.52 64.6,13.69 60.38,16.21 47.73,9.3 47.73,8.79 42.65,11.28 43.16,11.28 42.65,10.13 43.16,10.13 38.77,8.33 8.95,21.54 16.03,24.33 16.54,24.33 38.26,7.98 19.64,10.13 19.64,11.28 51.44,21.46 55.56,21.29 56.14,22.33 58.35,21.16 44.13,22.92 55.91,26.87 37.17,11.28 47.5,20.85 22.74,6.91 24.54,5.08 16.06,15.57 10.67,17.7 36.02,5.64 36.48,3.96 41.51,4.47 41.18,4.01 41.51,5.99 41.18,6.45 18.14,19.18 18.14,18.62 18.14,18.08 18.14,17.53 18.14,16.71 18.17,16.15 27.21,5.08 67.6,34.82 67.6,35.41 67.55,35.99 14.71,37.44 16.24,35.81 14.71,33.58 16.34,31.24 14.71,30.12 3.74,34.49 6.89,34.49 7.4,26.16 10.14,34.49 11.67,31.95 9.02,31.95 5.67,32.56 14.71,26.77 57.26,27.97 58.63,25.4 57.13,26.54 56.47,26.8 50.27,35.13 58.63,23.9 58.66,31.72 58.66,30.61 37.22,23.44 62.01,38.3 46.92,20.85 42.32,22.15 5.44,25.12 50.93,33.05 35.59,7.65 36.13,7.65 35.59,7.14 7.8,25.02 7.19,25.02 39.96,30.71 40.82,32.64 50.07,36.15 48.57,35.08 53.58,29.77 42.32,22.86 42.22,0.71 35.62,5.17 19.56,26.16 11.46,22.5 10.45,24.64 67.47,12.75 67.47,11.94 62.39,8.79 62.97,8.79 21.09,26.16 21.6,26.16 66.02,32.08 66.86,32.08 67.62,32.08 57.94,30.61 56.78,28.85
  pour Route2 (rank 4): 34.58,9.4 49.82,9.4 49.82,-0.46 34.58,-0.46
  pour Top (no thermals): 40.16,4.72 40.16,4.22 40.67,4.22 41.08,3.81 41.28,3.81 41.79,4.32 41.79,6.15 41.28,6.65 41.08,6.65 40.67,6.25 40.16,6.25 40.16,5.74 41.18,5.74 41.28,5.64 41.28,4.83 41.18,4.72
  cutout Bottom: 6.13,9.25 14.5,14.15 arc-70 17.51,12.41 20.28,7.63 arc-90 19.64,5.2 17.64,4.02 17.71,-0.28 12.36,-0.28 8.29,6.96 6.13,6.96
  cutout Top: 6.13,9.25 14.5,14.15 arc-70 17.51,12.41 20.28,7.63 arc-90 19.64,5.2 17.64,4.02 17.71,0.03 12.19,0.03 8.29,6.96 6.13,6.96
  cutout Route2: 6.13,9.25 14.5,14.15 arc-70 17.51,12.41 20.28,7.63 arc-90 19.64,5.2 17.64,4.02 17.71,-0.08 12.24,-0.08 8.29,6.96 6.13,6.96
  cutout Top: 34.17,-1.88 34.17,9.3 34.58,9.7 49.51,9.7 49.51,9.91 34.47,9.91 33.97,9.4 33.97,-2.08
  cutout Bottom: 34.17,-2.49 34.17,9.3 34.58,9.7 49.51,9.7 49.51,9.91 34.47,9.91 33.97,9.4 33.97,-2.69
  cutout Route15: 6.13,9.25 14.5,14.15 arc-70 17.51,12.41 20.28,7.63 arc-90 19.64,5.2 17.64,4.02 17.71,-0.18 12.3,-0.18 8.29,6.96 6.13,6.96
  pour Bottom (rank 4): 34.58,9.4 49.82,9.4 49.82,-0.66 34.58,-0.66
  pour Top (rank 4): 34.58,9.4 49.82,9.4 49.82,-0.36 34.58,-0.36
  cutout Bottom: 34.88,1.57 34.88,1.37 36.1,1.37 36.1,1.57
  cutout Bottom: 34.88,2.59 34.88,2.39 36.1,2.39 36.1,2.59
  cutout Bottom: 9.89,23.01 10.09,23.01 10.09,24.23 9.89,24.23
  cutout Bottom: 8.87,23.01 9.07,23.01 9.07,24.23 8.87,24.23
  pour Top (rank 6): -1.49,42.01 69.63,42.01 69.63,-1.17 -1.49,-1.17
  cutout Route2: 34.17,-2.08 34.17,9.3 34.58,9.7 49.51,9.7 49.51,9.91 34.47,9.91 33.97,9.4 33.97,-2.29
  pour Route2 (rank 6): -1.49,42.01 69.83,42.01 69.83,-1.37 -1.49,-1.37
  pour Bottom (rank 6): -1.49,42.01 70.24,42.01 70.24,-1.78 -1.49,-1.78
  cutout Top: 17.61,24.13 17.61,15.6 20.15,13.06 20.15,12.75 arc-90 20.05,12.65 arc-90 19.95,12.75 19.95,13.06 17.41,15.6 17.41,24.13 19.34,26.06 arc-90 19.44,26.06 arc-90 19.44,25.96
  cutout Bottom: 17.61,24.13 17.61,15.6 20.15,13.06 20.15,12.75 arc-90 20.05,12.65 arc-90 19.95,12.75 19.95,13.06 17.41,15.6 17.41,24.13 19.34,26.06 arc-90 19.44,26.06 arc-90 19.44,25.96
  cutout Route2: 17.61,24.13 17.61,23.16 17.41,23.16 17.41,24.13 19.34,26.06 arc-90 19.44,26.06 arc-90 19.44,25.96
GPIO0
  Top 0.203: U10.42 44.3,16.74 44.44,16.88 46.63,16.88 GPIO0.P$1
GPIO1
  Top 0.203: U10.43 45.8,17.24 46.46,17.91 GPIO1.P$1
GPIO2
  Top 0.203: U10.29 39.54,12.48 TP5.P$1
GPIO3
  Top 0.203: U10.28 39.04,12.52 TP6.P$1
LED_BLUE
  Top 0.203: U10.40 44.69,15.74 R13.2
LED_GREEN
  Top 0.203: U10.41 44.95,16.24 R12.2
LED_NRF_BLUE  (via drill 0.2)
  Top 0.203: U7.P23 v50.41,26.32 | R9.2 54.19,26.06 v54.06,26.06
  Bottom 0.203: v50.41,26.32 51.32,26.32 51.68,25.96 53.96,25.96 v54.06,26.06
LED_NRF_GREEN  (via drill 0.2)
  Top 0.203: v55.2,25.96 55.46,25.96 R8.2
  Bottom 0.203: U7.T23 50.57,25.8 50.74,25.96 51.25,25.96 51.55,25.65 54.9,25.65 v55.2,25.96
  other vias: 50.41,25.8
LED_NRF_RED  (via drill 0.2)
  Top 0.203: v56.36,25.76 56.83,25.76 R7.2 | U7.U24
  Bottom 0.203: v56.36,25.76 55.65,25.76 55.24,25.35 51.43,25.35 51.22,25.55 U7.U24
  other vias: 50.91,25.55
LED_RED
  Top 0.203: R11.2 44.89,14.43 44.07,15.24 U10.39
N$1
  Top 0.203: J1.B5 29.47,8.7 29.47,5.37 26.7,2.59 20.89,2.59 R19.1
N$2  (via drill 0.2)
  Top 0.305: Q2.B1 65.98,35.61 65.47,35.1 v65.46,35.1
  Top 0.406: D4.ANODE 65.77,33.96 65.54,34.19 v65.51,34.19 | v65.46,35.1 v64.93,35.1
  Bottom 0.406: LS1.- 64.43,30.71 65.51,31.79 v65.51,34.19 65.51,35.05 v65.46,35.1 v64.93,35.1
N$3
  Top 0.33: T1.1 26.3,12 U9.1
  pour Top: 32.39,12.04 32.39,11.94 arc90 32.42,11.91 32.42,12.04
N$4
  Top 0.33: C6.P$2 25.94,13.65 arc50 26.27,13.32 T1.3
N$5  (via drill 0.2)
  other vias: 13.65,17.32
N$6  (via drill 0.2)
  other vias: 13.65,16.51
N$7
  Top 0.33: C7.P$2 25.33,13.65 arc-50 25.01,13.32 T1.4
N$8
  Top 0.203: C25.1 21.51,14.54 21.53,14.53 R6.2
N$9
  cutout Top: 28.99,37.06 28.99,27.79 30.38,26.39 37.75,26.39 39.15,27.79 39.22,37.06
N$10
  cutout Bottom: 28.99,37.06 28.99,27.79 30.38,26.39 37.75,26.39 39.15,27.79 39.22,37.06
N$11
  Top 0.406: U5.4 23.83,29.13 C26.1
N$12
  Top 0.203: R27.2 18.8,18.75 18.8,17.91 C17.1
N$13
  Top 0.203: R18.1 20.63,3.81 21.55,2.9 25.53,2.9 26.62,3.98 J1.A5
N$14
  Top 0.203: U1.12 23.5,18.02 22.46,16.98 C16.1 22.46,15.42 R6.1
N$15
  Top 0.152: U7.H23 50.69,27.8 50.77,27.87 52.09,27.87 C2.1
  Top 0.33: C2.1 L1.2
N$16
  Top 0.203: U1.8 22.71,19.82 21.96,19.08 20,19.08 R27.1 19.82,18.8 C3.1
N$17
  cutout Route15: 56.17,28.09 58.91,27.23 58.91,26.18 56.17,27.04
  cutout Route2: 56.17,28.09 58.91,27.23 58.91,26.18 56.17,27.04
N$18
  Top 0.203: U7.B24 50.91,32.48 50.15,33.23 X3.3 49.18,33.93 C8.2
N$19
  Top 0.203: U7.A23 50.41,30.32 50.15,30.58 48.63,30.58 X3.1 47.26,31.95 C9.2
N$20
  cutout Bottom: 52.19,14.97 47.83,7.37 arc90 48.39,5.28 49.97,4.37 50.03,-0.66 55.61,-0.66 59.98,7.16 61.5,7.16 61.5,9.59
N$21
  Top 0.203: U1.5 20.4,21.02 20.15,21.27 19.19,21.27 18.75,20.84 R25.2
N$22
  Top 0.203: U10.44 44.8,17.74 R26.1
N$23  (via drill 0.2)
  Top 0.203: R12.1 50.43,16.31 51.34,17.22 52.25,17.22 TP7.P$1 53.47,15.9 57.44,13.56 v57.94,13.56 | D3.4 60.79,6.2 v60.79,6.25
  Route2 0.203: v57.94,13.56 59.34,13.56 59.85,13.06 61.65,13.06 62.87,11.84 64.09,11.84 64.34,11.58 64.34,8.69 61.91,6.25 v60.79,6.25